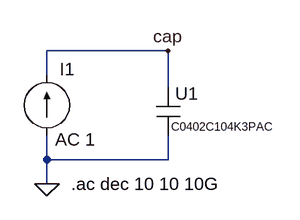
[diagram p0: schematic 01-C0402C104K3PAC.asc]
01-C0402C104K3PAC.asc, the LTspice schematic file:
Version 4
SHEET 1 1000 680
WIRE 208 80 48 80
WIRE 48 112 48 80
WIRE 208 128 208 80
WIRE 48 224 48 192
WIRE 208 224 208 192
WIRE 208 224 48 224
WIRE 48 256 48 224
FLAG 48 256 0
FLAG 208 80 cap
SYMBOL C0402C104K3PAC 208 160 R0
WINDOW 0 25 -39 Top 2
WINDOW 3 73 31 Bottom 1
SYMATTR InstName U1
SYMBOL current 48 192 R180
WINDOW 0 -37 88 Left 2
WINDOW 3 24 0 Left 2
WINDOW 123 -64 -5 Left 2
WINDOW 39 0 0 Left 0
SYMATTR InstName I1
SYMATTR Value ""
SYMATTR Value2 AC 1
TEXT 80 256 Left 2 !.ac dec 10 10 10G

The netlist it stands for:
* 01-C0402C104K3PAC.asc
XU1 cap 0 C0402C104K3PAC  ; pins 1 6
I1 0 cap AC 1
.ac dec 10 10 10G
.lib C:\Users\hop\Documents\GitHub\LTspice\01-lib\C0402C104K3PAC.CKT
.backanno
.end

* Results of the author's LTspice run, read from the files saved beside the schematic
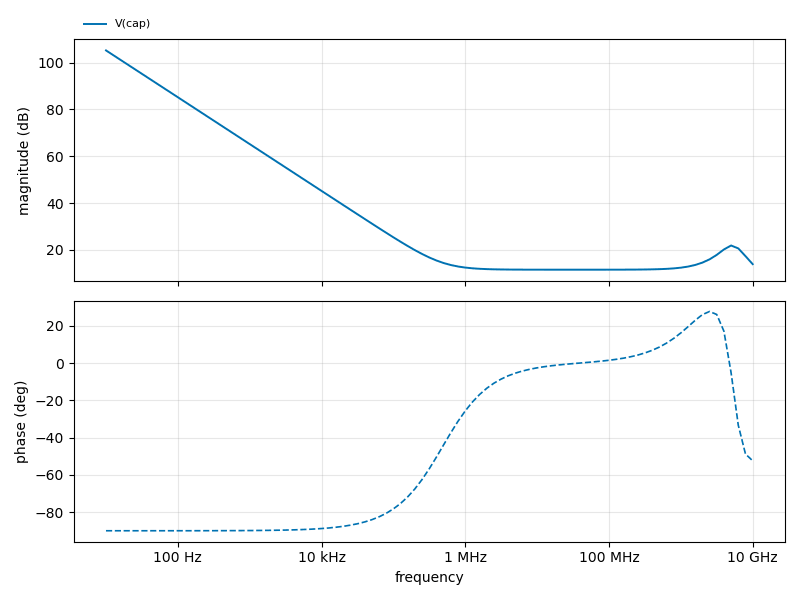
[diagram p1: AC Analysis of 01-C0402C104K3PAC.asc, plotted from the saved traces]
* AC Analysis, 1 run:
*   V(cap): 105.22 dB at 10 Hz, 13.93 dB at 10 GHz, peak 105.22 dB at 10 Hz, 3 dB below the peak at 14.14 Hz